# Altium schematic sheet 1166V10-4.SchDoc: Half-Bridge Phase 3
size A3; Author: M. Kutzsche; Organization: Kübrich Ing.-Gesellschaft; Address1: mbH & Co. KG; Address2: Weißmühle 10; Address3: D-96170 Priesendorf; DocumentNumber: UltraZohm; Revision: 10; SheetNumber: 4; SheetTotal: 5
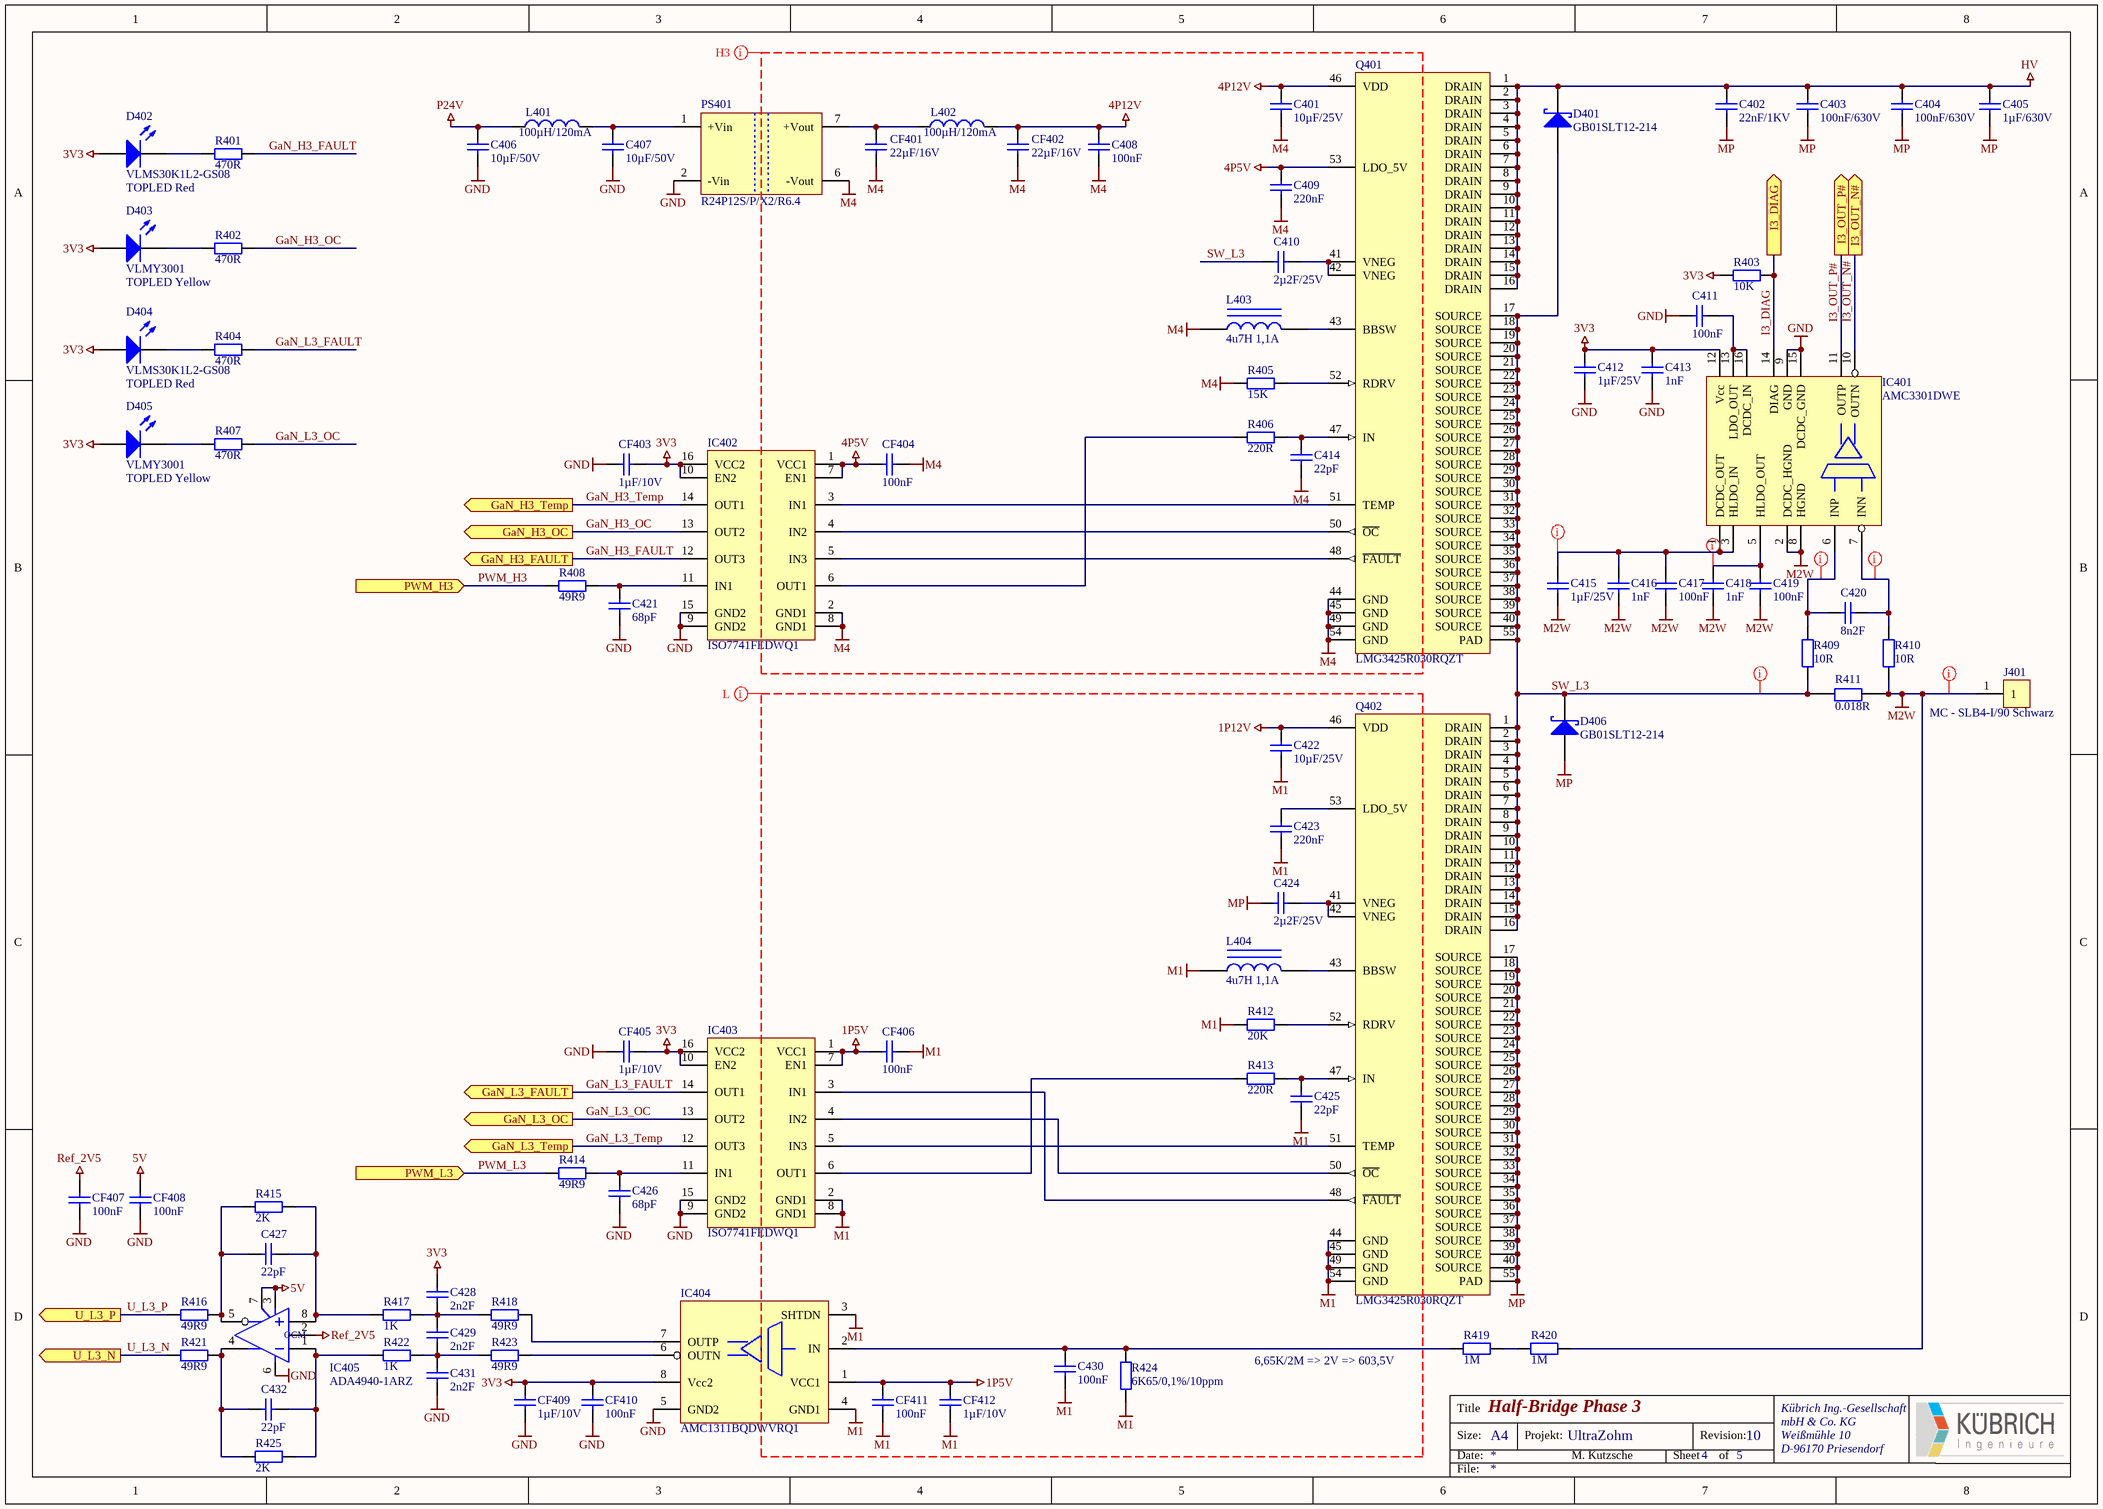
[diagram p0: 1166V10-4.SchDoc]

## Parts
C401  10µF/25V  [0805-Cap]
C402  22nF/1KV  [2220-Cap]
C403  100nF/630V  [2220-Cap]
C404  100nF/630V  [2220-Cap]
C405  1µF/630V  [2220-Cap]
C406  10µF/50V  [1206-Cap]
C407  10µF/50V  [1206-Cap]
C408  100nF  [0603-Cap]
C409  220nF  [0603-Cap]
C410  2µ2F/25V  [0805-Cap]
C411  100nF  [0603-Cap]
C412  1µF/25V  [1206-Cap]
C413  1nF  [1206-Cap]
C414  22pF  [0603-Cap]
C415  1µF/25V  [0603-Cap]
C416  1nF  [0603-Cap]
C417  100nF  [0603-Cap]
C418  1nF  [1206-Cap]
C419  100nF  [1206-Cap]
C420  8n2F  [0603-Cap]
C421  68pF  [0603-Cap]
C422  10µF/25V  [0805-Cap]
C423  220nF  [0603-Cap]
C424  2µ2F/25V  [0805-Cap]
C425  22pF  [0603-Cap]
C426  68pF  [0603-Cap]
C427  22pF  [0603-Cap]
C428  2n2F  [0603-Cap]
C429  2n2F  [0603-Cap]
C430  100nF  [0603-Cap]
C431  2n2F  [0603-Cap]
C432  22pF  [0603-Cap]
CF401  22µF/16V  [0805-Cap]
CF402  22µF/16V  [0805-Cap]
CF403  1µF/10V  [0603-Cap]
CF404  100nF  [0603-Cap]
CF405  1µF/10V  [0603-Cap]
CF406  100nF  [0603-Cap]
CF407  100nF  [0603-Cap]
CF408  100nF  [0603-Cap]
CF409  1µF/10V  [0603-Cap]
CF410  100nF  [0603-Cap]
CF411  100nF  [0603-Cap]
CF412  1µF/10V  [0603-Cap]
D401  GB01SLT12-214  [DO-214 (SMB)]
D402  VLMS30K1L2-GS08  Class II: TOPLED Red  [PLCC-2_rot]
D403  VLMY3001  Class II: TOPLED Yellow  [PLCC-2_gelb]
D404  VLMS30K1L2-GS08  Class II: TOPLED Red  [PLCC-2_rot]
D405  VLMY3001  Class II: TOPLED Yellow  [PLCC-2_gelb]
D406  GB01SLT12-214  [DO-214 (SMB)]
IC401  AMC3301DWE  [SOIC-16-W - 8.1mm]
IC402  ISO7741FEDWQ1  [SOIC-16-W - 8.1mm]
IC403  ISO7741FEDWQ1  [SOIC-16-W - 8.1mm]
IC404  AMC1311BQDWVRQ1  [SOIC-8-W]
IC405  ADA4940-1ARZ  [SOIC-8-N]
J401  MC - SLB4-I/90 Schwarz  [SLB4-I/90 - 4mm]
L401  100µH/120mA  [1007-IND (2518)]
L402  100µH/120mA  [1007-IND (2518)]
L403  4u7H 1,1A  [2.0mm x 1.6mm]
L404  4u7H 1,1A  [2.0mm x 1.6mm]
PS401  R24P12S/P/X2/R6.4  [SIP-7 Single - X2]
Q401  LMG3425R030RQZT  [VQFN-54 (RQZ0054)]
Q402  LMG3425R030RQZT  [VQFN-54 (RQZ0054)]
R401  470R  [0603-Res]
R402  470R  [0603-Res]
R403  10K  [0603-Res]
R404  470R  [0603-Res]
R405  15K  [0603-Res]
R406  220R  [0603-Res]
R407  470R  [0603-Res]
R408  49R9  [0603-Res]
R409  10R  [0603-Res]
R410  10R  [0603-Res]
R411  0.018R  [2512]
R412  20K  [0603-Res]
R413  220R  [0603-Res]
R414  49R9  [0603-Res]
R415  2K  [0603-Res]
R416  49R9  [0603-Res]
R417  1K  [0603-Res]
R418  49R9  [0603-Res]
R419  1M  [2512-Res]
R420  1M  [2512-Res]
R421  49R9  [0603-Res]
R422  1K  [0603-Res]
R423  49R9  [0603-Res]
R424  6K65/0,1%/10ppm  [0603-Res]
R425  2K  [0603-Res]

## Ports
GaN_H3_FAULT (out), GaN_H3_OC (out), GaN_H3_Temp (out), GaN_L3_FAULT (out), GaN_L3_OC (out), GaN_L3_Temp (out), I3_DIAG (out), I3_OUT_N# (out), I3_OUT_P# (out), PWM_H3 (in), PWM_L3 (in), U_L3_N (out), U_L3_P (out)

## Nets
1P5V: CF406.2 CF411.1 CF412.1 IC403.1(VCC1) IC403.7(EN1) IC404.1(VCC1)
1P12V: C422.2 Q402.46(VDD)
3V3: C412.1 C413.1 C428.2 CF403.1 CF405.1 CF409.1 CF410.1 D402.1(A) D403.1(A) D404.1(A) D405.1(A) IC401.12(Vcc) IC402.10(EN2) IC402.16(VCC2) IC403.10(EN2) IC403.16(VCC2) IC404.8(Vcc2) R403.2
4P5V: C409.2 CF404.2 IC402.1(VCC1) IC402.7(EN1) Q401.53(LDO_5V)
4P12V: C401.2 C408.1 CF402.1 L402.2 Q401.46(VDD)
5V: CF408.1 IC405.3(V+) IC405.7(EN)
GND: C406.1 C407.1 C411.1 C412.2 C413.2 C421.1 C426.1 C431.1 CF403.2 CF405.2 CF407.2 CF408.2 CF409.2 CF410.2 IC401.9(GND) IC401.15(DCDC_GND) IC402.9(GND2) IC402.15(GND2) IC403.9(GND2) IC403.15(GND2) IC404.5(GND2) IC405.6(V-) PS401.2(-Vin)
HV: C402.1 C403.1 C404.1 C405.1 D401.2(K) Q401.1(DRAIN) Q401.2(DRAIN) Q401.3(DRAIN) Q401.4(DRAIN) Q401.5(DRAIN) Q401.6(DRAIN) Q401.7(DRAIN) Q401.8(DRAIN) Q401.9(DRAIN) Q401.10(DRAIN) Q401.11(DRAIN) Q401.12(DRAIN) Q401.13(DRAIN) Q401.14(DRAIN) Q401.15(DRAIN) Q401.16(DRAIN)
M1: C422.1 C423.1 C425.1 C430.1 CF406.1 CF411.2 CF412.2 IC403.2(GND1) IC403.8(GND1) IC404.3(SHTDN) IC404.4(GND1) L404.1 Q402.44(GND) Q402.45(GND) Q402.49(GND) Q402.54(GND) R412.2 R424.2
M2W: C415.2 C416.2 C417.2 C418.2 C419.2 IC401.2(DCDC_HGND) IC401.8(HGND) J401.1 R410.1 R411.2 R420.2
M4: C401.1 C408.2 C409.1 C414.1 CF401.2 CF402.2 CF404.1 IC402.2(GND1) IC402.8(GND1) L403.1 PS401.6(-Vout) Q401.44(GND) Q401.45(GND) Q401.49(GND) Q401.54(GND) R405.2
MP: C402.2 C403.2 C404.2 C405.2 C424.2 D406.1(A) Q402.17(SOURCE) Q402.18(SOURCE) Q402.19(SOURCE) Q402.20(SOURCE) Q402.21(SOURCE) Q402.22(SOURCE) Q402.23(SOURCE) Q402.24(SOURCE) Q402.25(SOURCE) Q402.26(SOURCE) Q402.27(SOURCE) Q402.28(SOURCE) Q402.29(SOURCE) Q402.30(SOURCE) Q402.31(SOURCE) Q402.32(SOURCE) Q402.33(SOURCE) Q402.34(SOURCE) Q402.35(SOURCE) Q402.36(SOURCE) Q402.37(SOURCE) Q402.38(SOURCE) Q402.39(SOURCE) Q402.40(SOURCE) Q402.55(PAD)
P24V: C406.2 L401.1
Ref_2V5: CF407.1 IC405.2(OCM)
GaN_H3_FAULT: IC402.12(OUT3) R401.2 ; port GaN_H3_FAULT
GaN_H3_OC: IC402.13(OUT2) R402.2 ; port GaN_H3_OC
GaN_H3_Temp: IC402.14(OUT1) ; port GaN_H3_Temp
GaN_L3_FAULT: IC403.14(OUT1) R404.2 ; port GaN_L3_FAULT
GaN_L3_OC: IC403.13(OUT2) R407.2 ; port GaN_L3_OC
GaN_L3_Temp: IC403.12(OUT3) ; port GaN_L3_Temp
I3_DIAG: IC401.14(DIAG) R403.1 ; port I3_DIAG
I3_OUT_N#: IC401.10(OUTN) ; port I3_OUT_N#
I3_OUT_P#: IC401.11(OUTP) ; port I3_OUT_P#
PWM_H3: R408.2 ; port PWM_H3
PWM_L3: R414.2 ; port PWM_L3
SW_L3: C410.2 D401.1(A) D406.2(K) Q401.17(SOURCE) Q401.18(SOURCE) Q401.19(SOURCE) Q401.20(SOURCE) Q401.21(SOURCE) Q401.22(SOURCE) Q401.23(SOURCE) Q401.24(SOURCE) Q401.25(SOURCE) Q401.26(SOURCE) Q401.27(SOURCE) Q401.28(SOURCE) Q401.29(SOURCE) Q401.30(SOURCE) Q401.31(SOURCE) Q401.32(SOURCE) Q401.33(SOURCE) Q401.34(SOURCE) Q401.35(SOURCE) Q401.36(SOURCE) Q401.37(SOURCE) Q401.38(SOURCE) Q401.39(SOURCE) Q401.40(SOURCE) Q401.55(PAD) Q402.1(DRAIN) Q402.2(DRAIN) Q402.3(DRAIN) Q402.4(DRAIN) Q402.5(DRAIN) Q402.6(DRAIN) Q402.7(DRAIN) Q402.8(DRAIN) Q402.9(DRAIN) Q402.10(DRAIN) Q402.11(DRAIN) Q402.12(DRAIN) Q402.13(DRAIN) Q402.14(DRAIN) Q402.15(DRAIN) Q402.16(DRAIN) R409.1 R411.1
U_L3_N: R421.2 ; port U_L3_N
U_L3_P: R416.2 ; port U_L3_P
NetC407_2: C407.2 L401.2 PS401.1(+Vin)
NetC410_1: C410.1 Q401.41(VNEG) Q401.42(VNEG)
NetC411_2: C411.2 IC401.13(LDO_OUT) IC401.16(DCDC_IN)
NetC414_2: C414.2 Q401.47(IN) R406.1
NetC415_1: C415.1 C416.1 C417.1 IC401.1(DCDC_OUT) IC401.3(HLDO_IN)
NetC418_1: C418.1 C419.1 IC401.5(HLDO_OUT)
NetC420_1: C420.1 IC401.7(INN) R410.2
NetC420_2: C420.2 IC401.6(INP) R409.2
NetC421_2: C421.2 IC402.11(IN1) R408.1
NetC423_2: C423.2 Q402.53(LDO_5V)
NetC424_1: C424.1 Q402.41(VNEG) Q402.42(VNEG)
NetC425_2: C425.2 Q402.47(IN) R413.1
NetC426_2: C426.2 IC403.11(IN1) R414.1
NetC427_1: C427.1 IC405.8(+) R415.1 R417.2
NetC427_2: C427.2 IC405.5(Out) R415.2 R416.1
NetC428_1: C428.1 C429.2 R417.1 R418.2
NetC429_1: C429.1 C431.2 R422.1 R423.2
NetC430_2: C430.2 IC404.2(IN) R419.1 R424.1
NetC432_1: C432.1 IC405.1(-) R422.2 R425.1
NetC432_2: C432.2 IC405.4(Out) R421.1 R425.2
NetCF401_1: CF401.1 L402.1 PS401.7(+Vout)
NetD402_2: D402.2(K) R401.1
NetD403_2: D403.2(K) R402.1
NetD404_2: D404.2(K) R404.1
NetD405_2: D405.2(K) R407.1
NetIC402_3: IC402.3(IN1) Q401.51(TEMP)
NetIC402_4: IC402.4(IN2) Q401.50(~{OC})
NetIC402_5: IC402.5(IN3) Q401.48(~{FAULT})
NetIC402_6: IC402.6(OUT1) R406.2
NetIC403_3: IC403.3(IN1) Q402.48(~{FAULT})
NetIC403_4: IC403.4(IN2) Q402.50(~{OC})
NetIC403_5: IC403.5(IN3) Q402.51(TEMP)
NetIC403_6: IC403.6(OUT1) R413.2
NetIC404_6: IC404.6(OUTN) R423.1
NetIC404_7: IC404.7(OUTP) R418.1
NetL403_2: L403.2 Q401.43(BBSW)
NetL404_2: L404.2 Q402.43(BBSW)
NetQ401_52: Q401.52(RDRV) R405.1
NetQ402_52: Q402.52(RDRV) R412.1
NetR419_2: R419.2 R420.1

## Layout directives
net class H3: 4P5V, 4P12V, M2W, M4, NetC415_1, NetC418_1, NetC420_1, NetC420_2, SW_L3
net class L: 1P5V, 1P12V, M1, MP

## Notes on the sheet
- 6,65K/2M => 2V => 603,5V
- Title
- Size:
- Date:
- A4
- Projekt:
- Sheet
- Revision:
- of
- File:

## Library data of the parts
C401-C432 CF401-CF412 = Cap_SMD: Capacitor (SMD); Class I: Pasiv; Class II: Capacitor; Last edited: 20.11.2006 10:25
  C401 C422: value: 10µF/25V
  C402: value: 22nF/1KV
  C403 C404: value: 100nF/630V
  C405: value: 1µF/630V
  C406 C407: value: 10µF/50V
  C408 C411 C417 C419 C430 CF404 CF406-CF408 CF410 CF411: value: 100nF
  C409 C423: value: 220nF
  C410 C424: value: 2µ2F/25V
  C412 C415: value: 1µF/25V
  C413 C416 C418: value: 1nF
  C414 C425 C427 C432: value: 22pF
  C420: value: 8n2F
  C421 C426: value: 68pF
  C428 C429 C431: value: 2n2F
  CF401 CF402: value: 22µF/16V
  CF403 CF405 CF409 CF412: value: 1µF/10V
D401 D406 = GB01SLT12-214: Silicon Carbide Schottky Diode Vr=1200V If=1A; Manufacturer: GeneSiC Semiconductor; Class I: Discret; Package information: Unknown; Best.-Nr.: DigiKey: 1242-1169-1-ND; Class II: Silicon Carbide Schottky Diode Vr=1200V If=1A; Datasheet: Ver. 7 Nov 2000; Package reference: DO-214AA (SMB)
D402 D404 = VLMS30K1L2-GS08: Top LED Super red, 2mA, 18mcd, -40-100°C; Manufacturer: Vishay; Class I: Discrete; Best.-Nr.: Farnell 132-8349; Last edited: 23.01.2007 08:58
D403 D405 = VLMY3001: Top LED Yellow, 2mA, 18mcd, -40-100°C; Manufacturer: Vishay; Class I: Discrete; Best.-Nr.: ???; Last edited: 23.01.2007 08:58
IC401 = AMC3301DWE: ±250 mV Input Voltage Range, Reinforced Isolated Amplifier and High Bandwidth of 300 kHz; Manufacturer: Texas Instruments; Class II: ±250 mV, 300KHz, -40-125°C; Package information: Unknown; Best.-Nr.: DigiKey: 296-AMC3301DWE-ND; Class I: Isolated Amplifier; Datasheet: Unknown; Package reference: SOIC-16-W
IC402 IC403 = ISO7741FEDWQ1: Quad-CH 100Mbps Isolators 1 IN/3 OUT, 5000V Reinforced, (-40-150°C); Manufacturer: Anaolog Devices; Class I: Optocoupler; Package information: Unknown; Best.-Nr.: DigiKey: 296-ISO7741FEDWQ1-ND; Class II: Quad-CH 100Mbps Isolators 1 IN/3 OUT, 5000V Reinforced, (-40-150°C); Datasheet: Unknown; Package reference: SOIC-16W
IC404 = AMC1311BQDWVRQ1: 2V Input, Automotive High-Impedance, Reinforced Isolated Amplifier for Voltage Sensing; Manufacturer: Texas Instruments; Class II: 2V, 275KHz, -40-125°C; Package information: Unknown; Best.-Nr.: Mouser: 595-AMC1311BQDWVRQ1; Class I: Isolated Amplifier; Datasheet: Unknown; Package reference: SOIC-8-W
IC405 = ADA4940-1ARZ: Fully Differential ADC Drivers (-40-125°C); Manufacturer: ANALOG DEVICES; Class I: Analog; Best.-Nr.: Farnell 209-6178; Class II: Fully Differential ADC Drivers (-40-125°C); Datasheet: DSO11449, Ver. Aug 2000; Last edited: 04.01.2007 10:14; Package Reference: SOIC-N-8
J401 = MC - SLB4-I/90 Schwarz: Labor Winkelbuchsen 4mm Schwarz; Manufacturer: Multi-Contact; Class I: Connectors; Best.-Nr.: Farnell: 108-5521; Class II: Labor Winkelbuchsen 4mm Schwarz; Last edited: 07.03.2007 13:28
L401 L402 = CB2518T101K: 100µH, 60/120mA. (1007), -40-105°C; Manufacturer: Taiyo Yuden; Class I: Pasive; Best.-Nr.: DigiKey:   587-2192-1-ND; Class II: 100µH, 60/120mA. (1007), -40-105°C; Last edited: 08.12.2006 12:28
L403 L404 = SDEM20161T-4R7MS: Power Choke 4u7H 1,1A; Manufacturer: Delta Electronics/Cyntec; Class I: Pasive; Best.-Nr.: DigiKey: 2037-SDEM20161T-4R7MSCT-ND; Class II: Power Choke 4u7H 1,1A; Last edited: 15.03.2007 11:19
PS401 = R24P12S/P/X2/R6.4: DC/DC Converter 24V to 12V, 1W, 84mA (unregulated) 6,4KVDC Rainforced; Manufacturer: Recom; Class I: Analog; Package information: Unknown; Best.-Nr.: Mouser: 919-R24P12SX2PR6.4; Class II: DC/DC Converter 24V to 12V, 1W, 84mA (unregulated) 6,4KVDC Rainforced; Package reference: SIP-7; Datasheet: Rev. 28 Apr 2002
Q401 Q402 = LMG3425R030RQZT: GaN FET Power Stage With Cycle-by-cycle Overcurrent Protection 600V/40A/30mOhm; Manufacturer: Texas Instruments; Class I: Discret; Package information: Unknown; Best.-Nr.: TI-Shop; Class II: GaN FET Power Stage With Cycle-by-cycle Overcurrent Protection 600V/40A/30mOhm; Datasheet: LMG3425R030; Package reference: VQFN-32
R401-R410 R412-R418 R421-R425 = Res_SMD: Resistor SMD; Class I: Pasiv; Class II: Resistor; Last edited: 17.11.2006 11:38
  R401 R402 R404 R407: value: 470R
  R403: value: 10K
  R405: value: 15K
  R406 R413: value: 220R
  R408 R414 R416 R418 R421 R423: value: 49R9
  R409 R410: value: 10R
  R412: value: 20K
  R415 R425: value: 2K
  R417 R422: value: 1K
  R424: value: 6K65/0,1%/10ppm
R411 = MCLRP12DTDRR018: 18mOhm, 3W, 0,5%, 50ppm/°C; Manufacturer: Milticomp; Class I: Pasiv; Class II: Shunt 3W; Best.-Nr.: Farnell: 282-8111; Last edited: 23.11.2010 14:12; value: 0.018R
R419 R420 = HVCB2512BDE1M00: Resistor SMD 1M/0,1%/3KV/2W/25ppm/°C; Class I: Pasiv; Best.-Nr.: DigiKey: HVCB2512BDE1M00CT-ND; Class II: Resistor; Last edited: 17.11.2006 11:38; value: 1M